# Altium project VDT.PrjPcb
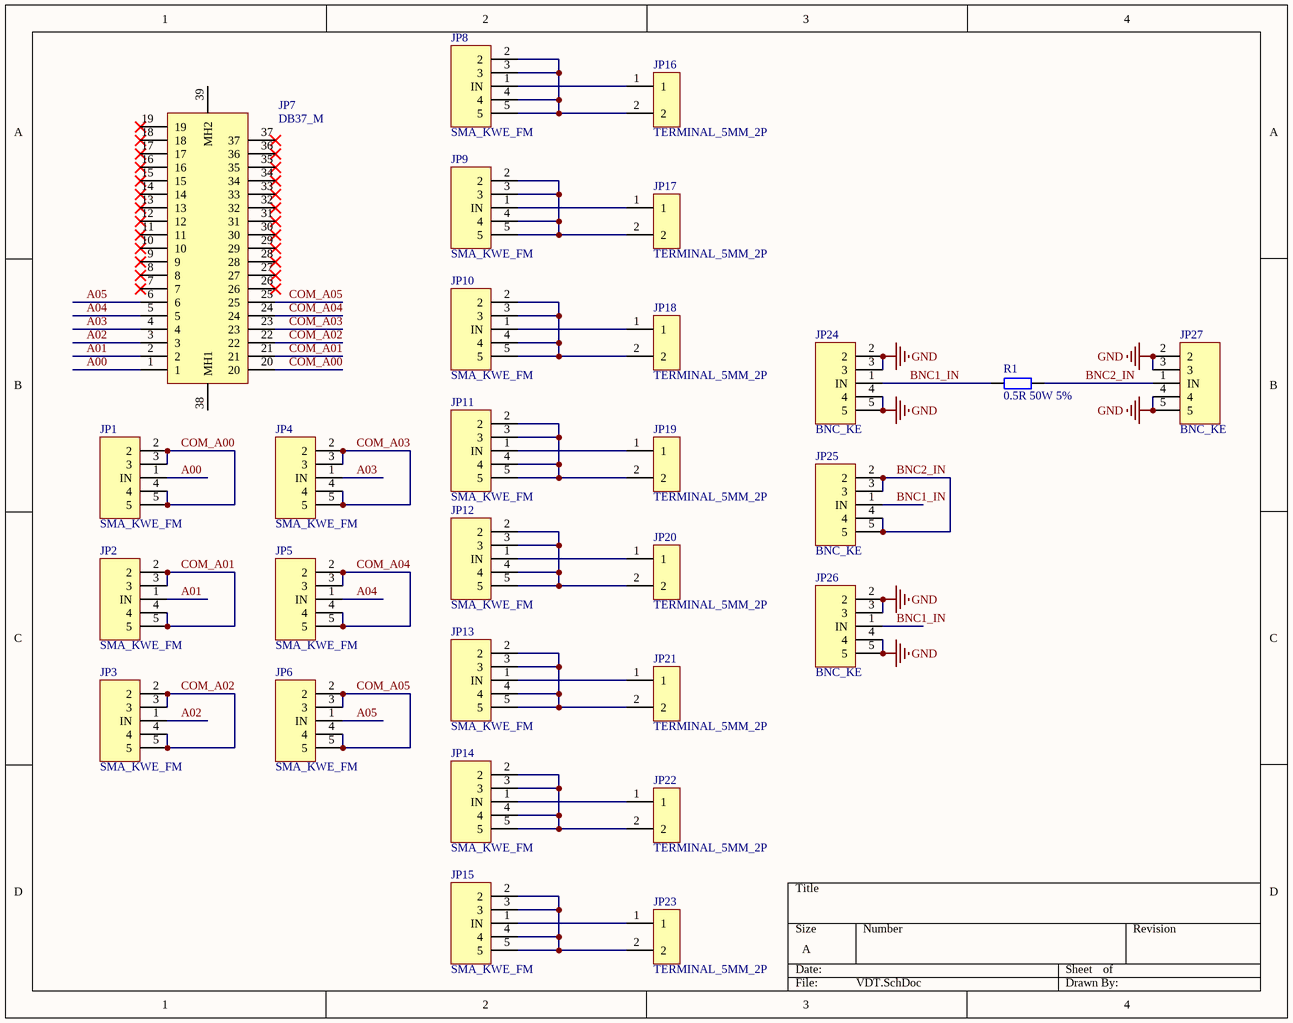
[diagram p0: VDT.SchDoc]
1 sheet, 28 parts. Net scope: global (net labels, ports and power ports of the same name join across sheets).
Board file: VDT.PcbDoc

## Sheet VDT.SchDoc
size A; SheetNumber: 1; SheetTotal: 1

### Parts
JP1  SMA_KWE_FM  [SMA-KWE]
JP2  SMA_KWE_FM  [SMA-KWE]
JP3  SMA_KWE_FM  [SMA-KWE]
JP4  SMA_KWE_FM  [SMA-KWE]
JP5  SMA_KWE_FM  [SMA-KWE]
JP6  SMA_KWE_FM  [SMA-KWE]
JP7  DB37_M  [DB37]
JP8  SMA_KWE_FM  [SMA-KWE]
JP9  SMA_KWE_FM  [SMA-KWE]
JP10  SMA_KWE_FM  [SMA-KWE]
JP11  SMA_KWE_FM  [SMA-KWE]
JP12  SMA_KWE_FM  [SMA-KWE]
JP13  SMA_KWE_FM  [SMA-KWE]
JP14  SMA_KWE_FM  [SMA-KWE]
JP15  SMA_KWE_FM  [SMA-KWE]
JP16  TERMINAL_5MM_2P  [TERMINAL_5MM_2P]
JP17  TERMINAL_5MM_2P  [TERMINAL_5MM_2P]
JP18  TERMINAL_5MM_2P  [TERMINAL_5MM_2P]
JP19  TERMINAL_5MM_2P  [TERMINAL_5MM_2P]
JP20  TERMINAL_5MM_2P  [TERMINAL_5MM_2P]
JP21  TERMINAL_5MM_2P  [TERMINAL_5MM_2P]
JP22  TERMINAL_5MM_2P  [TERMINAL_5MM_2P]
JP23  TERMINAL_5MM_2P  [TERMINAL_5MM_2P]
JP24  BNC_KE  [BNC-KE]
JP25  BNC_KE  [BNC-KE]
JP26  BNC_KE  [BNC-KE]
JP27  BNC_KE  [BNC-KE]
R1  0.5R 50W 5%  [HS50_P_RES]

### Nets
GND: JP24.2 JP24.3 JP24.4 JP24.5 JP26.2 JP26.3 JP26.4 JP26.5 JP27.2 JP27.3 JP27.4 JP27.5
A00: JP1.1(IN) JP7.1
A01: JP2.1(IN) JP7.2
A02: JP3.1(IN) JP7.3
A03: JP4.1(IN) JP7.4
A04: JP5.1(IN) JP7.5
A05: JP6.1(IN) JP7.6
BNC1_IN: JP24.1(IN) JP25.1(IN) JP26.1(IN) R1.1
BNC2_IN: JP25.2 JP25.3 JP25.4 JP25.5 JP27.1(IN) R1.2
COM_A00: JP1.2 JP1.3 JP1.4 JP1.5 JP7.20
COM_A01: JP2.2 JP2.3 JP2.4 JP2.5 JP7.21
COM_A02: JP3.2 JP3.3 JP3.4 JP3.5 JP7.22
COM_A03: JP4.2 JP4.3 JP4.4 JP4.5 JP7.23
COM_A04: JP5.2 JP5.3 JP5.4 JP5.5 JP7.24
COM_A05: JP6.2 JP6.3 JP6.4 JP6.5 JP7.25
NetJP8_1: JP8.1(IN) JP16.1
NetJP8_2: JP8.2 JP8.3 JP8.4 JP8.5 JP16.2
NetJP9_1: JP9.1(IN) JP17.1
NetJP9_2: JP9.2 JP9.3 JP9.4 JP9.5 JP17.2
NetJP10_1: JP10.1(IN) JP18.1
NetJP10_2: JP10.2 JP10.3 JP10.4 JP10.5 JP18.2
NetJP11_1: JP11.1(IN) JP19.1
NetJP11_2: JP11.2 JP11.3 JP11.4 JP11.5 JP19.2
NetJP12_1: JP12.1(IN) JP20.1
NetJP12_2: JP12.2 JP12.3 JP12.4 JP12.5 JP20.2
NetJP13_1: JP13.1(IN) JP21.1
NetJP13_2: JP13.2 JP13.3 JP13.4 JP13.5 JP21.2
NetJP14_1: JP14.1(IN) JP22.1
NetJP14_2: JP14.2 JP14.3 JP14.4 JP14.5 JP22.2
NetJP15_1: JP15.1(IN) JP23.1
NetJP15_2: JP15.2 JP15.3 JP15.4 JP15.5 JP23.2

Not connected (* = marked no-connect by the designer): JP7 7* 8* 9* 10* 11* 12* 13* 14* 15* 16* 17* 18* 19* 26* 27* 28* 29* 30* 31* 32* 33* 34* 35* 36* 37* 38(MH1) 39(MH2)

### Library data of the parts
JP1-JP6 JP8-JP15 = SMA_KWE_FM: SMA Connector Jack, Female Socket 50 Ohms Through Hole Solder; Manufacturer: Adam Tech; Manufacture Part Number: RF2-04A-T-00-50-G; Packaging: Bulk; Link: https://www.digikey.cn/en/products/detail/adam-tech/RF2-04A-T-00-50-G/9830588; Price: $2.20; Viet Nam Link: https://linhkienchatluong.vn/de-anten/de-anten-sma-5-chan-cai-thang-sma-ke_sp1035_ct8354.aspx
JP7 = DB37_M: 37 Position D-Sub Plug, Male Pins Connector; Manufacturer: TE Connectivity AMP Connectors; Manufacture Part Number: 2301836-1; Packaging: Tray; Link: https://www.digikey.cn/en/products/detail/te-connectivity-amp-connectors/2301836-1/7776540; Price: $5.80; Viet Nam Link: https://linhkien.cxt.vn/6261-db37-cong-duc-37p-chan-thang-2-hang-han-pcb.html
JP16-JP23 = TERMINAL_5MM_2P: 2 Position Wire to Board Terminal Block Horizontal with Board 0.197" (5.00mm) Through Hole; Manufacturer: Würth Elektronik; Manufacture Part Number: 691137710002; Packaging: Bulk; Link: https://www.digikey.cn/en/products/detail/w%C3%BCrth-elektronik/691137710002/6644051; Price: $0.41; Viet Nam Link: https://linhkienchatluong.vn/cau-dau-kf127/cau-dau-2p-kf127-508mm-mau-xanh-chinh-hang-meigan_sp868_ct4100.aspx
JP24-JP27 = BNC_KE: BNC Connector Jack, Female Socket 50 Ohms Through Hole Solder; Manufacturer: TE Connectivity Linx; Manufacture Part Number: CONBNC001; Packaging: Tray; Link: https://www.digikey.cn/en/products/detail/te-connectivity-linx/CONBNC001/16013844; Price: $1.84; Viet Nam Link: https://linhkien888.vn/dau-bnc-ke-female-han-mach
R1 = RHS50_50W_0.5R: 500 mOhms ±5% 50W Wirewound Chassis Mount Resistor; Manufacturer: TE Connectivity Passive Product; Manufacture Part Number: HSA50R50J; Packaging: Cut Tape (CT); Link: https://www.digikey.cn/en/products/detail/te-connectivity-passive-product/HSA50R50J/2366456; Price: $5.78; Viet Nam Link: https://linhkienchatluong.vn/dien-tro-nhom-50w/dien-tro-nhom-50w-05r-5-rx24-50w05r_sp478_ct3334.aspx